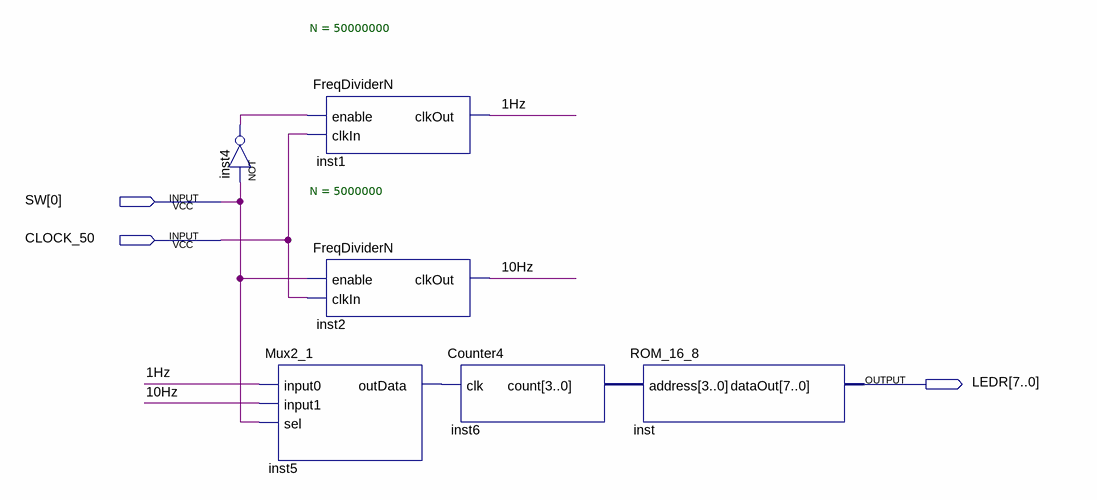
[diagram p0: schematic sheet]
// Quartus schematic ROM_Demo.bdf as structural Verilog: 6 symbols, 3 pins
module ROM_Demo (
  input  [0:0] SW,
  input  CLOCK_50,
  output [7:0] LEDR
);

  wire \1Hz , \10Hz , inst4_out, inst5_outdata;
  wire [3:0] inst6_count;

  not inst4 (inst4_out, SW[0]);
  Mux2_1 inst5 (.input0(\1Hz ), .input1(\10Hz ), .sel(SW[0]), .outData(inst5_outdata));
  FreqDividerN #(.N(50000000)) inst1 (.enable(inst4_out), .clkIn(CLOCK_50), .clkOut(\1Hz ));
  FreqDividerN #(.N(5000000)) inst2 (.enable(SW[0]), .clkIn(CLOCK_50), .clkOut(\10Hz ));
  Counter4 inst6 (.clk(inst5_outdata), .count(inst6_count));
  ROM_16_8 inst (.address(inst6_count), .dataOut(LEDR));
endmodule
